# Altium schematic sheet Sheet1.SchDoc
size A4
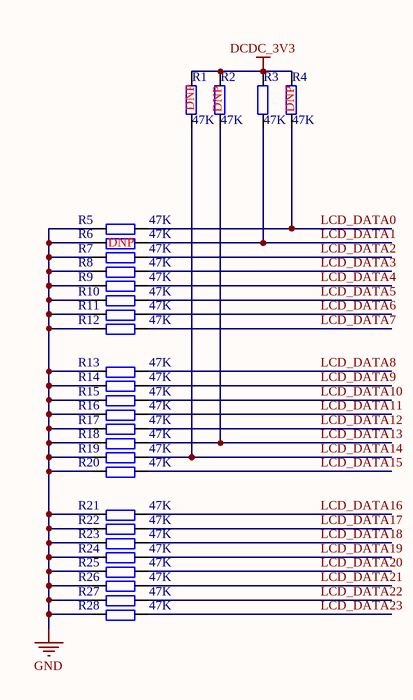
[diagram p0: Sheet1.SchDoc]

## Parts
R1  47K  [R 0402]
R2  47K  [R 0402]
R3  47K  [R 0402]
R4  47K  [R 0402]
R5  47K  [R 0402]
R6  47K  [R 0402]
R7  47K  [R 0402]
R8  47K  [R 0402]
R9  47K  [R 0402]
R10  47K  [R 0402]
R11  47K  [R 0402]
R12  47K  [R 0402]
R13  47K  [R 0402]
R14  47K  [R 0402]
R15  47K  [R 0402]
R16  47K  [R 0402]
R17  47K  [R 0402]
R18  47K  [R 0402]
R19  47K  [R 0402]
R20  47K  [R 0402]
R21  47K  [R 0402]
R22  47K  [R 0402]
R23  47K  [R 0402]
R24  47K  [R 0402]
R25  47K  [R 0402]
R26  47K  [R 0402]
R27  47K  [R 0402]
R28  47K  [R 0402]

## Nets
DCDC_3V3: R1.1 R2.1 R3.1 R4.1
GND: R5.1 R6.1 R7.1 R8.1 R9.1 R10.1 R11.1 R12.1 R13.1 R14.1 R15.1 R16.1 R17.1 R18.1 R19.1 R20.1 R21.1 R22.1 R23.1 R24.1 R25.1 R26.1 R27.1 R28.1
LCD_DATA0: R4.2 R5.2
LCD_DATA1: R3.2 R6.2
LCD_DATA2: R7.2
LCD_DATA3: R8.2
LCD_DATA4: R9.2
LCD_DATA5: R10.2
LCD_DATA6: R11.2
LCD_DATA7: R12.2
LCD_DATA8: R13.2
LCD_DATA9: R14.2
LCD_DATA10: R15.2
LCD_DATA11: R16.2
LCD_DATA12: R17.2
LCD_DATA13: R2.2 R18.2
LCD_DATA14: R1.2 R19.2
LCD_DATA15: R20.2
LCD_DATA16: R21.2
LCD_DATA17: R22.2
LCD_DATA18: R23.2
LCD_DATA19: R24.2
LCD_DATA20: R25.2
LCD_DATA21: R26.2
LCD_DATA22: R27.2
LCD_DATA23: R28.2

## Notes on the sheet
- (near R1) DNP
- (near R2) DNP
- (near R4) DNP
- (near R6) DNP

## Library data of the parts
R1-R28 = R